# Altium schematic sheet Main.SchDoc
size A; SheetNumber: 1; SheetTotal: 4
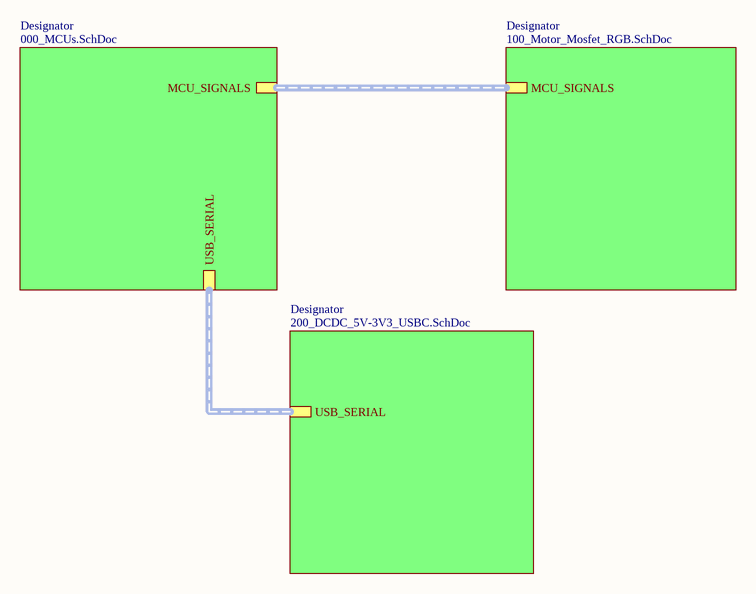
[diagram p0: Main.SchDoc]

## Sub-sheets
Designator = 000_MCUs.SchDoc: MCU_SIGNALS (harness MCU_SIGNALS), USB_SERIAL (harness USB_SERIAL)
Designator = 100_Motor_Mosfet_RGB.SchDoc: MCU_SIGNALS (harness MCU_SIGNALS)
Designator = 200_DCDC_5V-3V3_USBC.SchDoc: USB_SERIAL (harness USB_SERIAL)